# EAGLE design Netzteil (EAGLE 5.06)
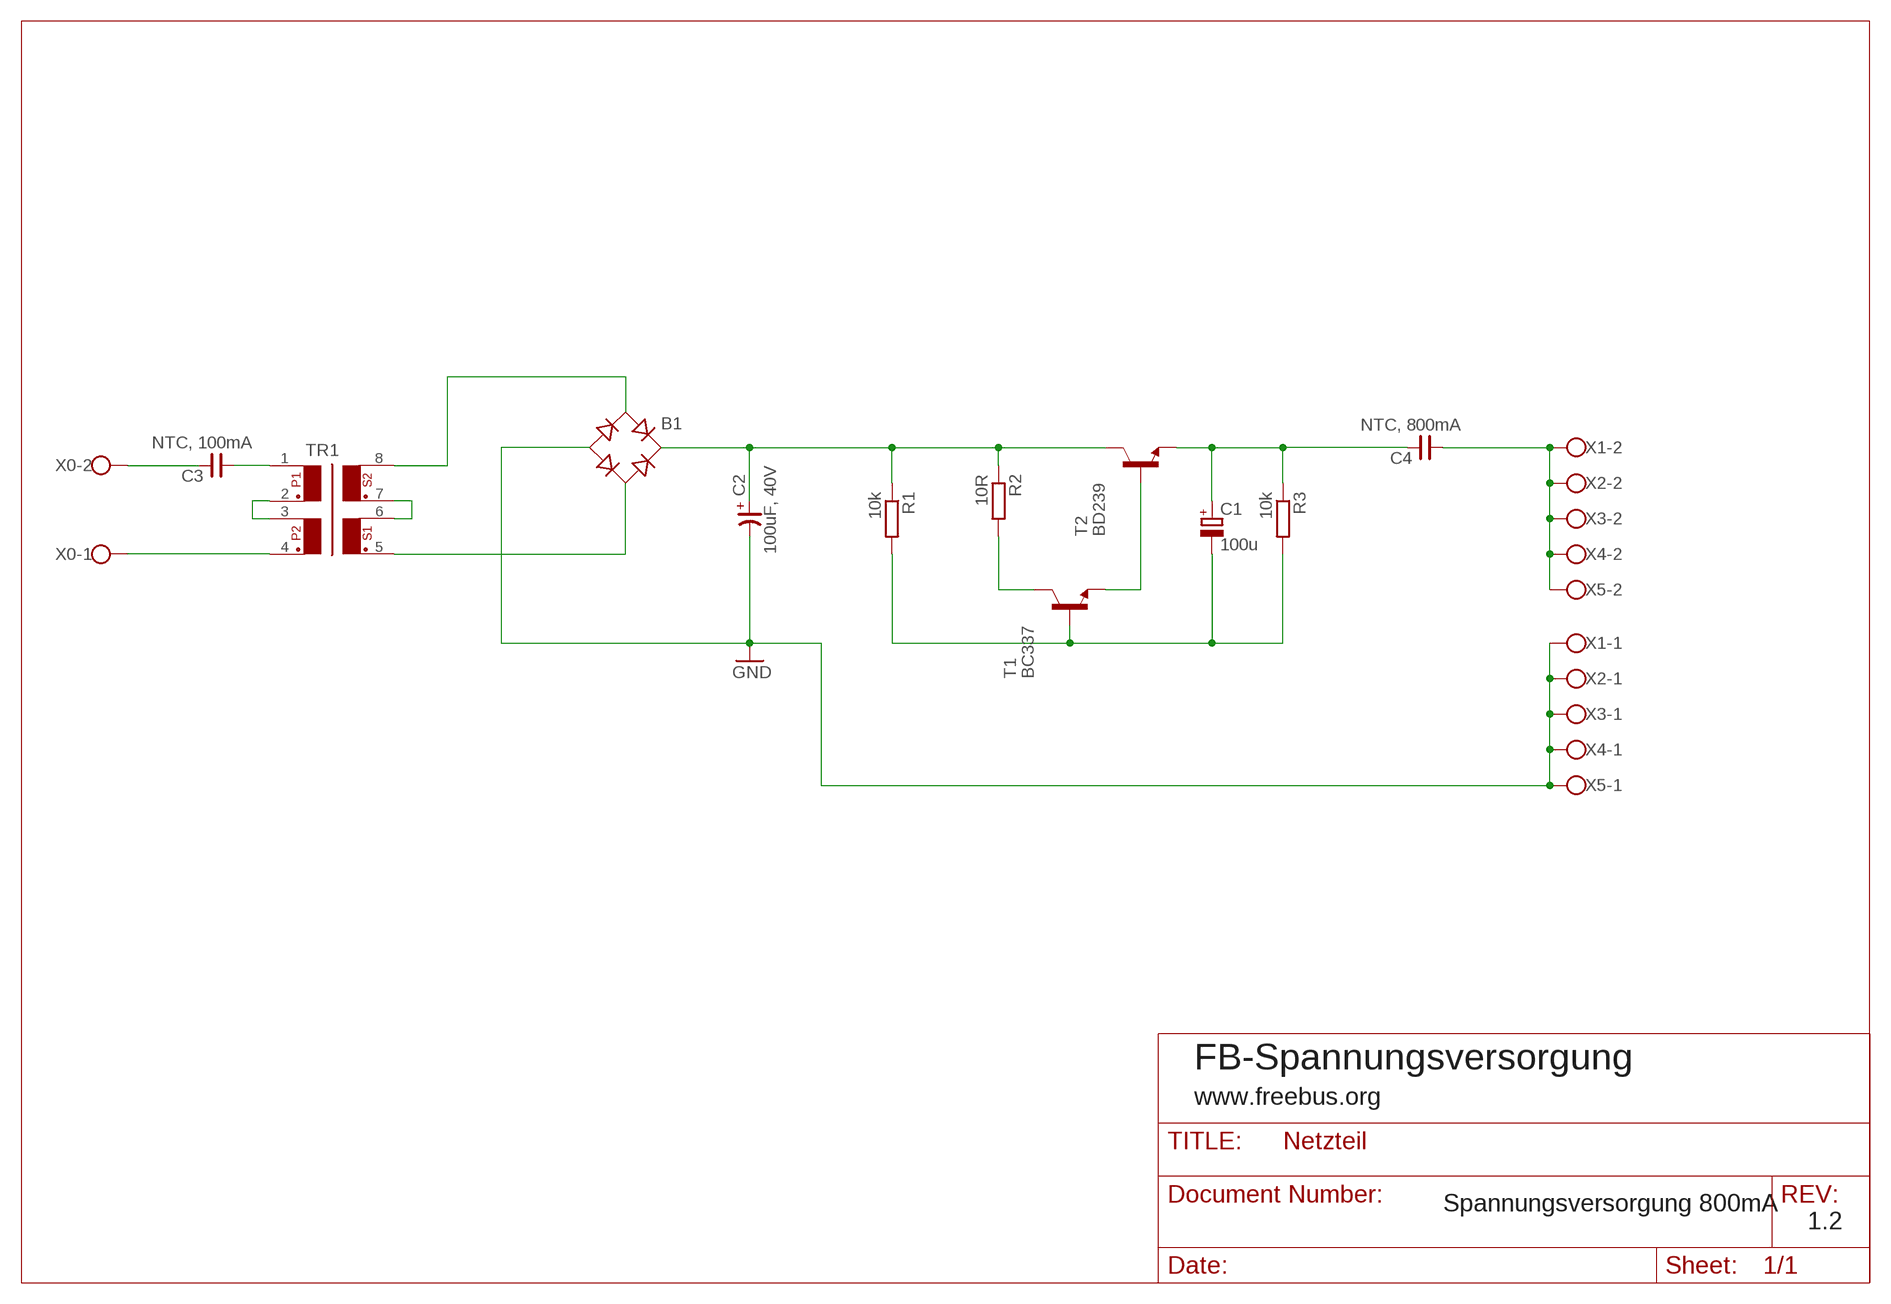
[diagram p0: schematic, sheet 1]

## Parts
B1  RB1A  [RB1A]
C1  100u  CPOL-EUE5-13  [E5-13]
C2  100uF, 40V  CP-E-050X120  [E-050X120]
C3  NTC, 100mA  CNP-C050-075X035  [C050-075X035]
C4  NTC, 800mA  CNP-C050-075X035  [C050-075X035]
R1  10k  R-EU_0207/10  [0207/10]
R2  10R  R-EU_0207/10  [0207/10]
R3  10k  R-EU_0207/10  [0207/10]
T1  BC337  [TO92]
T2  BD239  [TO220]
TR1  FL10  [FL10-30]
X0  W237-102  [W237-102]
X1  W237-102  [W237-102]
X2  W237-102  [W237-102]
X3  W237-102  [W237-102]
X4  W237-102  [W237-102]
X5  W237-102  [W237-102]

## Nets
GND: B1.- C2.- X1.1 X2.1 X3.1 X4.1 X5.1
N$1: B1.+ C2.+ R1.1 R2.1 T2.2(C)
N$2: C4.1 X1.2 X2.2 X3.2 X4.2 X5.2
N$3: TR1.2 TR1.3
N$4: T1.1(E) T2.1(B)
N$5: R2.2 T1.3(C)
N$6: C3.1 TR1.1
N$7: TR1.6 TR1.7
N$8: B1.AC2 TR1.5
N$9: B1.AC1 TR1.8
N$10: C3.2 X0.2
N$11: TR1.4 X0.1
N$16: C1.+ C4.2 R3.1 T2.3(E)
N$25: C1.- R1.2 R3.2 T1.2(B)

## Notes on the sheet
- FB-Spannungsversorgung
- www.freebus.org
- Spannungsversorgung 800mA
- 1.2

## Library data of the parts
B1 = rectifier:RB1A: RECTIFIER 1 A
C1 = rcl:CPOL-EU: POLARIZED CAPACITOR, European symbol
C2 = cap-master:CP-: POLARIZED CAP
C3 C4 = cap-master:CNP-: NON-POLARIZED CAP
R1-R3 = rcl:R-EU_: RESISTOR, European symbol
T1 = transistor:BC337: NPN TRANSISTOR
T2 = transistor:BD239: NPN TRANSISTOR Source: http://www.fairchildsemi.com/ds/BD/BD239C.pdf
TR1 = trafo:FL10: TRANSFORMER 2 primary winding, 2 secondary windings, mounting holes BLOCK
X0 X1-X5 = con-wago-500:W237-102: WAGO SCREW CLAMP

## Net classes
0 SELV: width 0.406 mm
1 230Vac: width 1.93 mm, clearance 5.08 mm to class 0, clearance 1.905 mm

## Board
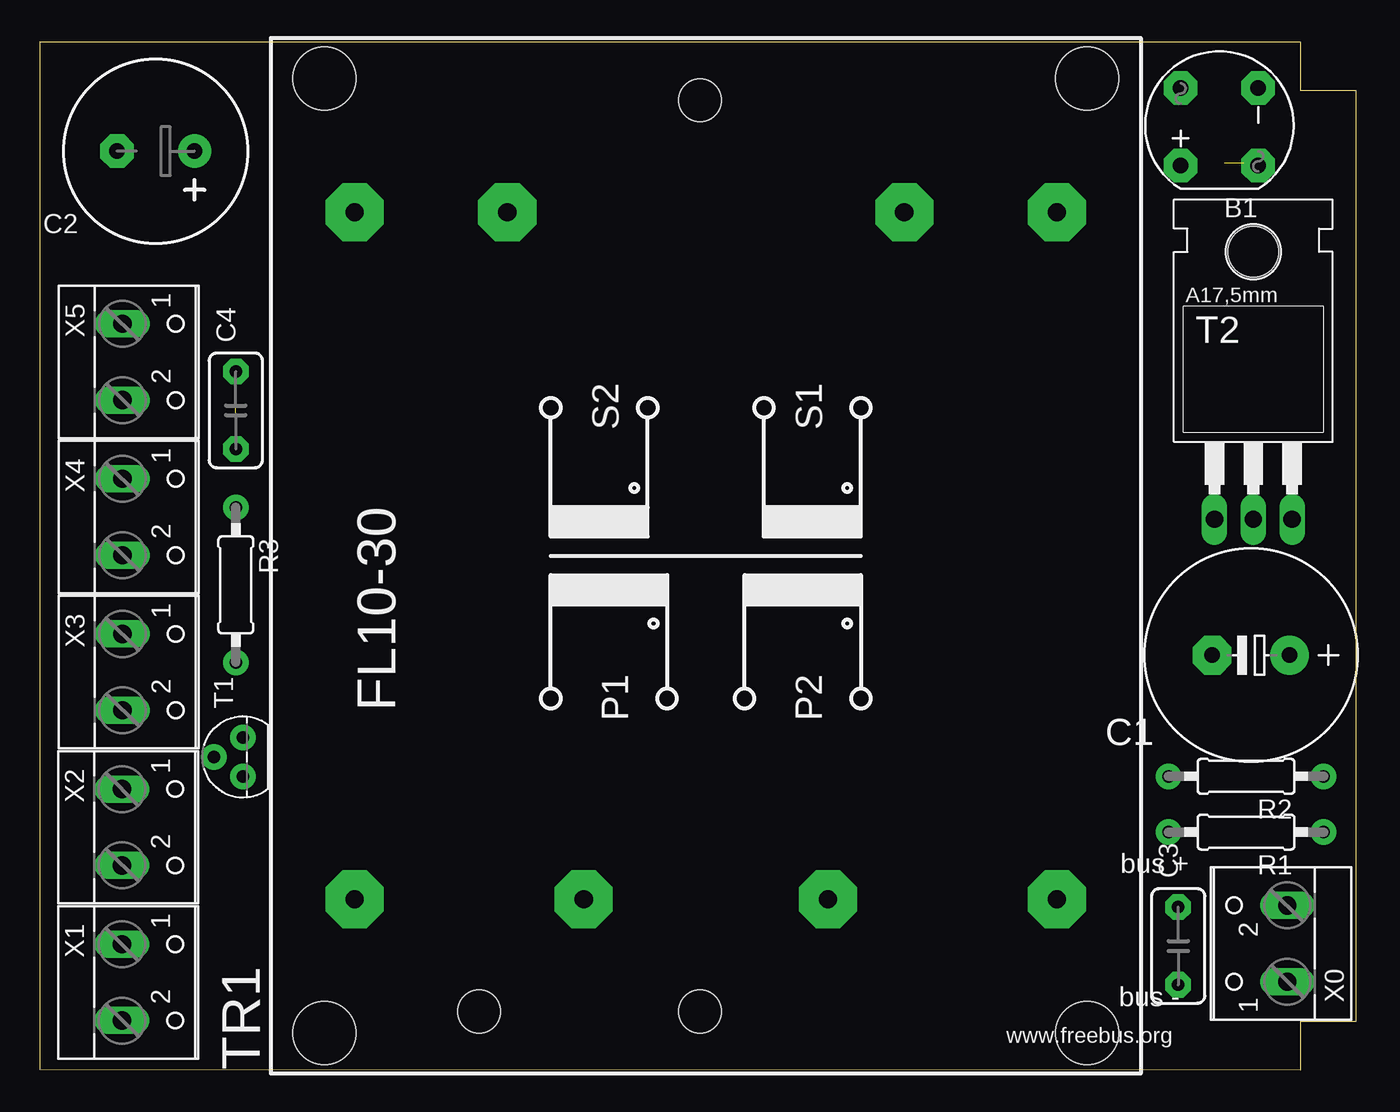
[diagram p1: board, top side]
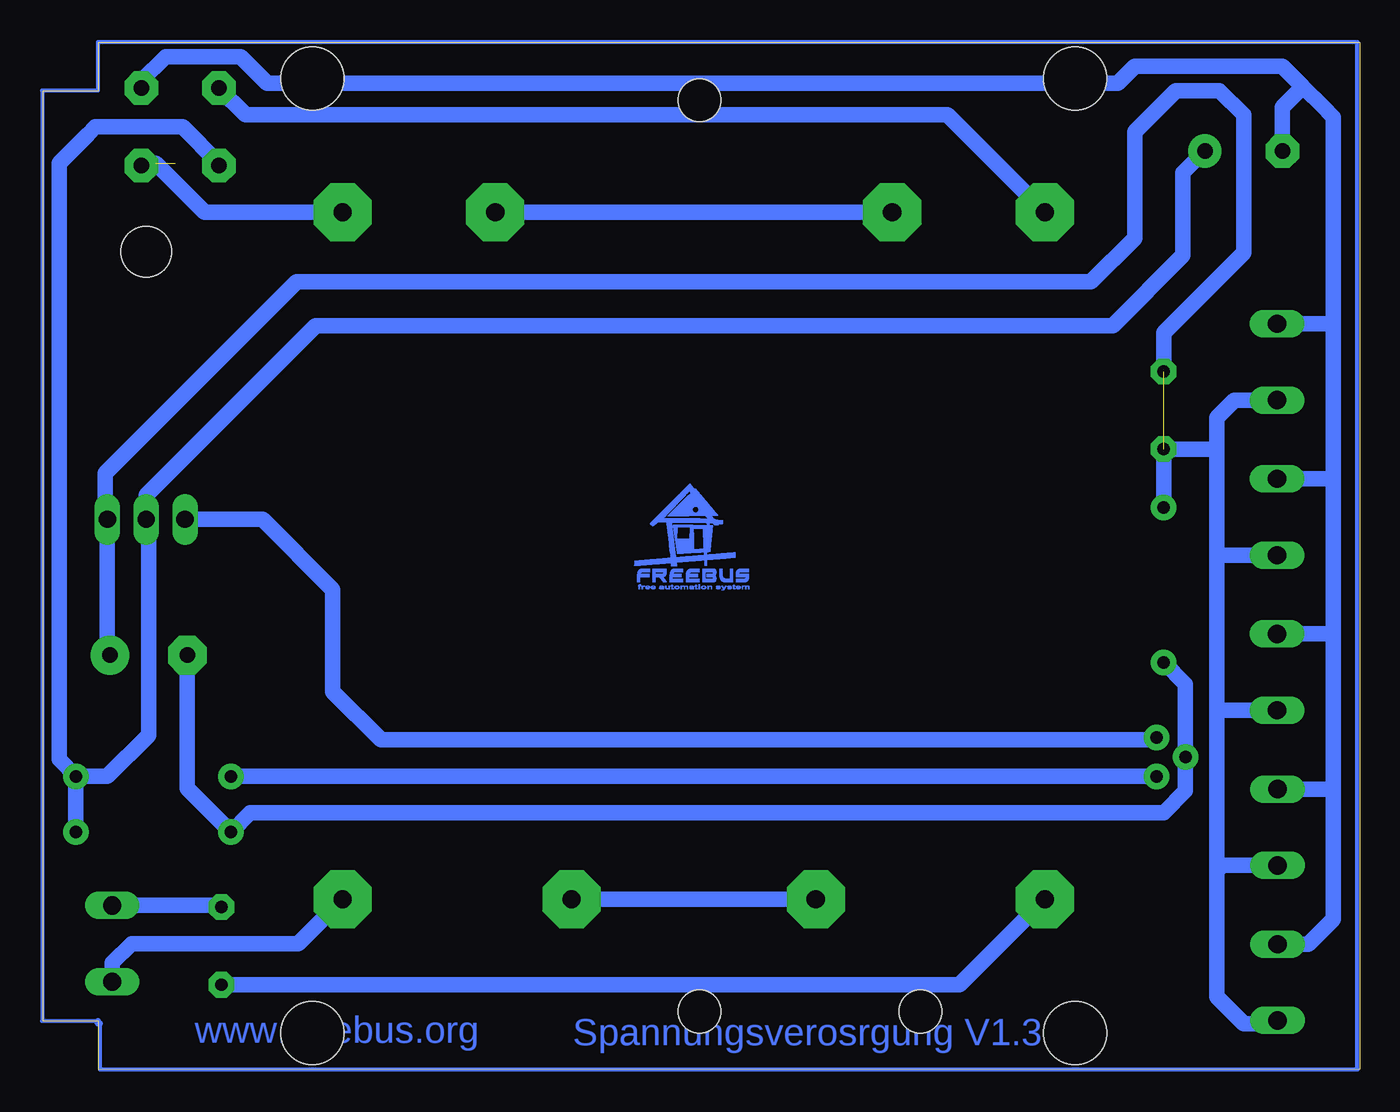
[diagram p2: board, bottom side, seen from below]

Size 86.28 x 67.31 mm. Coordinates in mm from the lower left corner, seen from the top.
Outline: 0,0.01 82.64,0 82.64,3.18 86.28,3.18 86.28,64.13 82.64,64.13 82.64,67.31 0,67.31 0,0.01
Copper layers (1*16): Top 0.035mm / dielectric 1.5mm / Bottom 0.035mm
Design rules "default": minimum track width 10mil, minimum drill 24mil, track to track 16mil, track to pad 12mil, pad to pad 16mil, via to via 16mil, smd to smd 8mil, copper to edge 20mil, drill to drill 10mil, minimum pad ring 10mil, minimum via ring 8mil, stop-mask expansion 4mil, vias tented up to drill 0mil, thermal gap 10mil
Holes 2.8 mm at 43.27,3.81 43.27,63.5 28.79,3.81
tRestrict: area 39,52.7 to 48,61.2

### Footprints (pad centres in the part's own frame; a part is rotated, then mirrored left to right if it is on the bottom)
RB1A = drill 1.016 round: + -2.54,2.54 | drill 1.016 octagon: - 2.54,-2.54; AC1 2.54,2.54; AC2 -2.54,-2.54
E5-13 = drill 1.016 pad 2.54 round: + -2.54,0 | drill 1.016 pad 2.54 octagon: - 2.54,0
E-050X120 = drill 1.016 pad 2.184 round: + -2.54,0 | drill 1.016 pad 2.184 octagon: - 2.54,0
C050-075X035 = drill 0.813 pad 1.676 octagon: 1 -2.54,0; 2 2.54,0
0207/10 = drill 0.813 octagon: 1 -5.08,0; 2 5.08,0
TO92 = drill 0.813 octagon: 1 1.27,0; 2 0,1.905; 3 -1.27,0
TO220 = drill 1.118 long: 1 -2.54,-6.35; 2 0,-6.35; 3 2.54,-6.35 | hole 3.302: 0,11.176
FL10-30 = drill 1.194 pad 3.81 octagon: 1 -22.504,23.012; 2 -22.504,8.001; 3 -22.504,-8.001; 4 -22.504,-23.012; 5 22.504,-23.012; 6 22.504,-13.005; 7 22.504,13.005; 8 22.504,23.012 | hole 4.115: -31.267,24.994; 31.267,24.994; 31.267,-24.994; -31.267,-24.994
W237-102 = drill 1.194 long: 1 -2.5,-1.27; 2 2.5,-1.27

### Placement (x,y rotation side)
B1  77.3,61.75 90 top
C1  79.37,27.15 180 top
C2  7.61,60.17 180 top
C3  74.61,8.1 90 top
C4  12.85,43.18 90 top
R1  79.05,15.56 180 top
R2  79.05,19.21 180 top
R3  12.85,31.75 270 top
T1  13.33,20.48 90 top
T2  79.53,42.39 0 top
TR1  43.65,33.66 90 top
X0  80.48,8.26 90 top
X1  6.66,5.71 270 top
X2  6.66,15.88 270 top
X3  6.69,26.04 270 top
X4  6.69,36.2 270 top
X5  6.69,46.36 270 top

### Tracks (layer width: path | path; a pad name or v marks a point on that pad's centre or on a via)
GND
  Bottom 1.016: X1.1 3.37,8.21 1.74,9.84 1.74,18.26 | 1.74,18.26 1.74,28.42 | 1.74,28.42 1.74,38.73 | 1.74,38.73 1.74,48.89 | X5.1 1.78,48.85 1.74,48.89 | X4.1 1.78,38.7 1.74,38.73 | X3.1 1.86,28.54 1.74,28.42 | X2.1 1.86,18.38 1.74,18.26 | 2.38,63.02 1.9,62.55 | 2.38,63.02 3.72,64.37 | 1.74,48.89 1.74,62.39 2.38,63.02 | C2.- 5.07,63.02 3.72,64.37 | 3.72,64.37 5.07,65.72 14.76,65.72 15.87,64.61 71.59,64.61 73.34,66.36 78.26,66.36 79.84,64.77 B1.-
N$1  (via drill 0.6 pad 1.68)
  Bottom 1.016: R2.1 R1.1 | R1.1 | R2.1 | R2.1 82.07,19.21 79.37,21.91 79.37,35.88 T2.2 | R2.1 | C2.+ 11.58,58.74 11.58,53.34 16.19,48.74 68.41,48.74 79.53,37.62 T2.2 | R2.1 85.24,20.32 85.24,59.37 83.34,61.28 82.86,61.75 77.15,61.75 74.77,59.37 B1.+ | T2.2
  other vias: 84.13,19.21 84.13,15.56
N$2
  Bottom 1.016: X5.2 8.21,43.85 9.36,42.7 9.36,40.8 | 9.36,13.02 9.36,4.76 7.61,3.02 5.59,3.02 X1.2 | 9.36,13.02 9.36,23.34 | 9.36,23.34 9.36,33.81 | 9.36,33.81 9.36,40.64 | 9.36,40.64 9.36,40.8 | X2.2 9,13.38 9.36,13.02 | X3.2 9.16,23.54 9.36,23.34 | X4.2 9.24,33.7 9.36,33.81 | 9.36,40.8 9.52,40.64 | 9.36,40.64 C4.1 | 9.36,40.64
N$3
  Bottom 1.016: TR1.2 TR1.3
N$4
  Bottom 1.016: T1.1 13.49,21.59 64.13,21.59 67.3,24.77 67.3,31.43 71.91,36.04 T2.1
N$5  (via drill 0.6 pad 1.68)
  Bottom 1.016: T1.3 | T1.3 R2.2 | R2.2
  other vias: 13.33,19.21
N$6
  Bottom 1.016: C3.1 26.23,5.56 TR1.1
N$7
  Bottom 1.016: TR1.7 TR1.6
N$8  (1 unrouted)
  Bottom 1.016: B1.AC2 79.69,59.37 78.89,59.37 75.68,56.16 TR1.5
N$9
  Bottom 1.016: TR1.8 27.03,62.55 73.02,62.55 B1.AC1
N$10
  Bottom 1.016: X0.2 74.72,10.75 C3.2
N$11
  Bottom 1.016: X0.1 81.75,6.98 80.48,8.26 69.56,8.26 TR1.4
N$16  (via drill 0.6 pad 1.68)  (1 unrouted)
  Bottom 1.016: C1.+ 82.31,27.54 82.07,27.78 T2.3 | C4.2 12.85,48.26 7.61,53.5 7.61,62.55 9.2,64.14 12.06,64.14 14.76,61.44 14.76,54.45 17.61,51.59 69.69,51.59 82.23,39.05 82.23,36.2 T2.3 | T2.3 | R3.1 v12.85,40.64 | v12.85,40.64
N$17  (via drill 2 pad 3)
  other vias: 79.53,53.5
N$19  (via drill 0.6 pad 1.68)
  other vias: 12.85,45.72
N$24  (via drill 0.9 pad 2.18)
  other vias: 74.77,59.21
N$25
  Bottom 1.016: C1.- 76.83,18.42 R1.2 72.7,16.83 12.85,16.83 11.42,18.26 T1.2 11.42,25.24 R3.2
N$28  (via drill 0.9 pad 2.18)
  other vias: 79.84,64.29
N$31  (via drill 0.9 pad 2.18)
  other vias: 79.84,59.21
N$32  (via drill 0.9 pad 2.18)
  other vias: 74.77,64.29
N$33  (via drill 0.6 pad 1.68)
  other vias: 12.85,36.83
N$34  (via drill 0.6 pad 1.68)
  other vias: 12.85,26.67
N$36  (via drill 0.6 pad 1.68)
  other vias: 13.33,21.75
N$37  (via drill 0.6 pad 1.68)
  other vias: 11.42,20.48
N$38  (via drill 0.6 pad 1.68)
  other vias: 73.97,15.56
N$39  (via drill 0.6 pad 1.68)
  other vias: 73.97,19.21
S$1
  Bottom 0.254: 82.7,3.17 86.35,3.17 86.35,64.14 82.7,64.14 82.7,67.31 0.15,67.31 0.15,0 82.54,0 82.54,3.02
  Bottom 0.406: 82.7,3.17 82.7,3.02 82.54,3.02
(copper drawn outside any net)
  shapes: Bottom area x3730

### Text on the board
Bottom: Spannungsverosrgung V1.3 | www.freebus.org
tPlace: bus + | bus -
tNames: www.freebus.org
Document: A5 | A4 | A6 | A3 | A7 | A2 | A8 | A1 | EIB + | Vext+ | EIB - | Vext-
Drill_legend: Bohrlegende | Datum: 10.01.2009 22:11:37 | 2.8000 mm / 110.236 mil | 1.6000 mm / 62.992 mil | 1.3000 mm / 51.181 mil | 1.2000 mm / 47.244 mil | 1.1000 mm / 43.307 mil | 1.0000 mm / 39.370 mil | 0.9000 mm / 35.433 mil | 0.5000 mm / 19.685 mil